# EAGLE design pix6t4 (EAGLE 5.11)
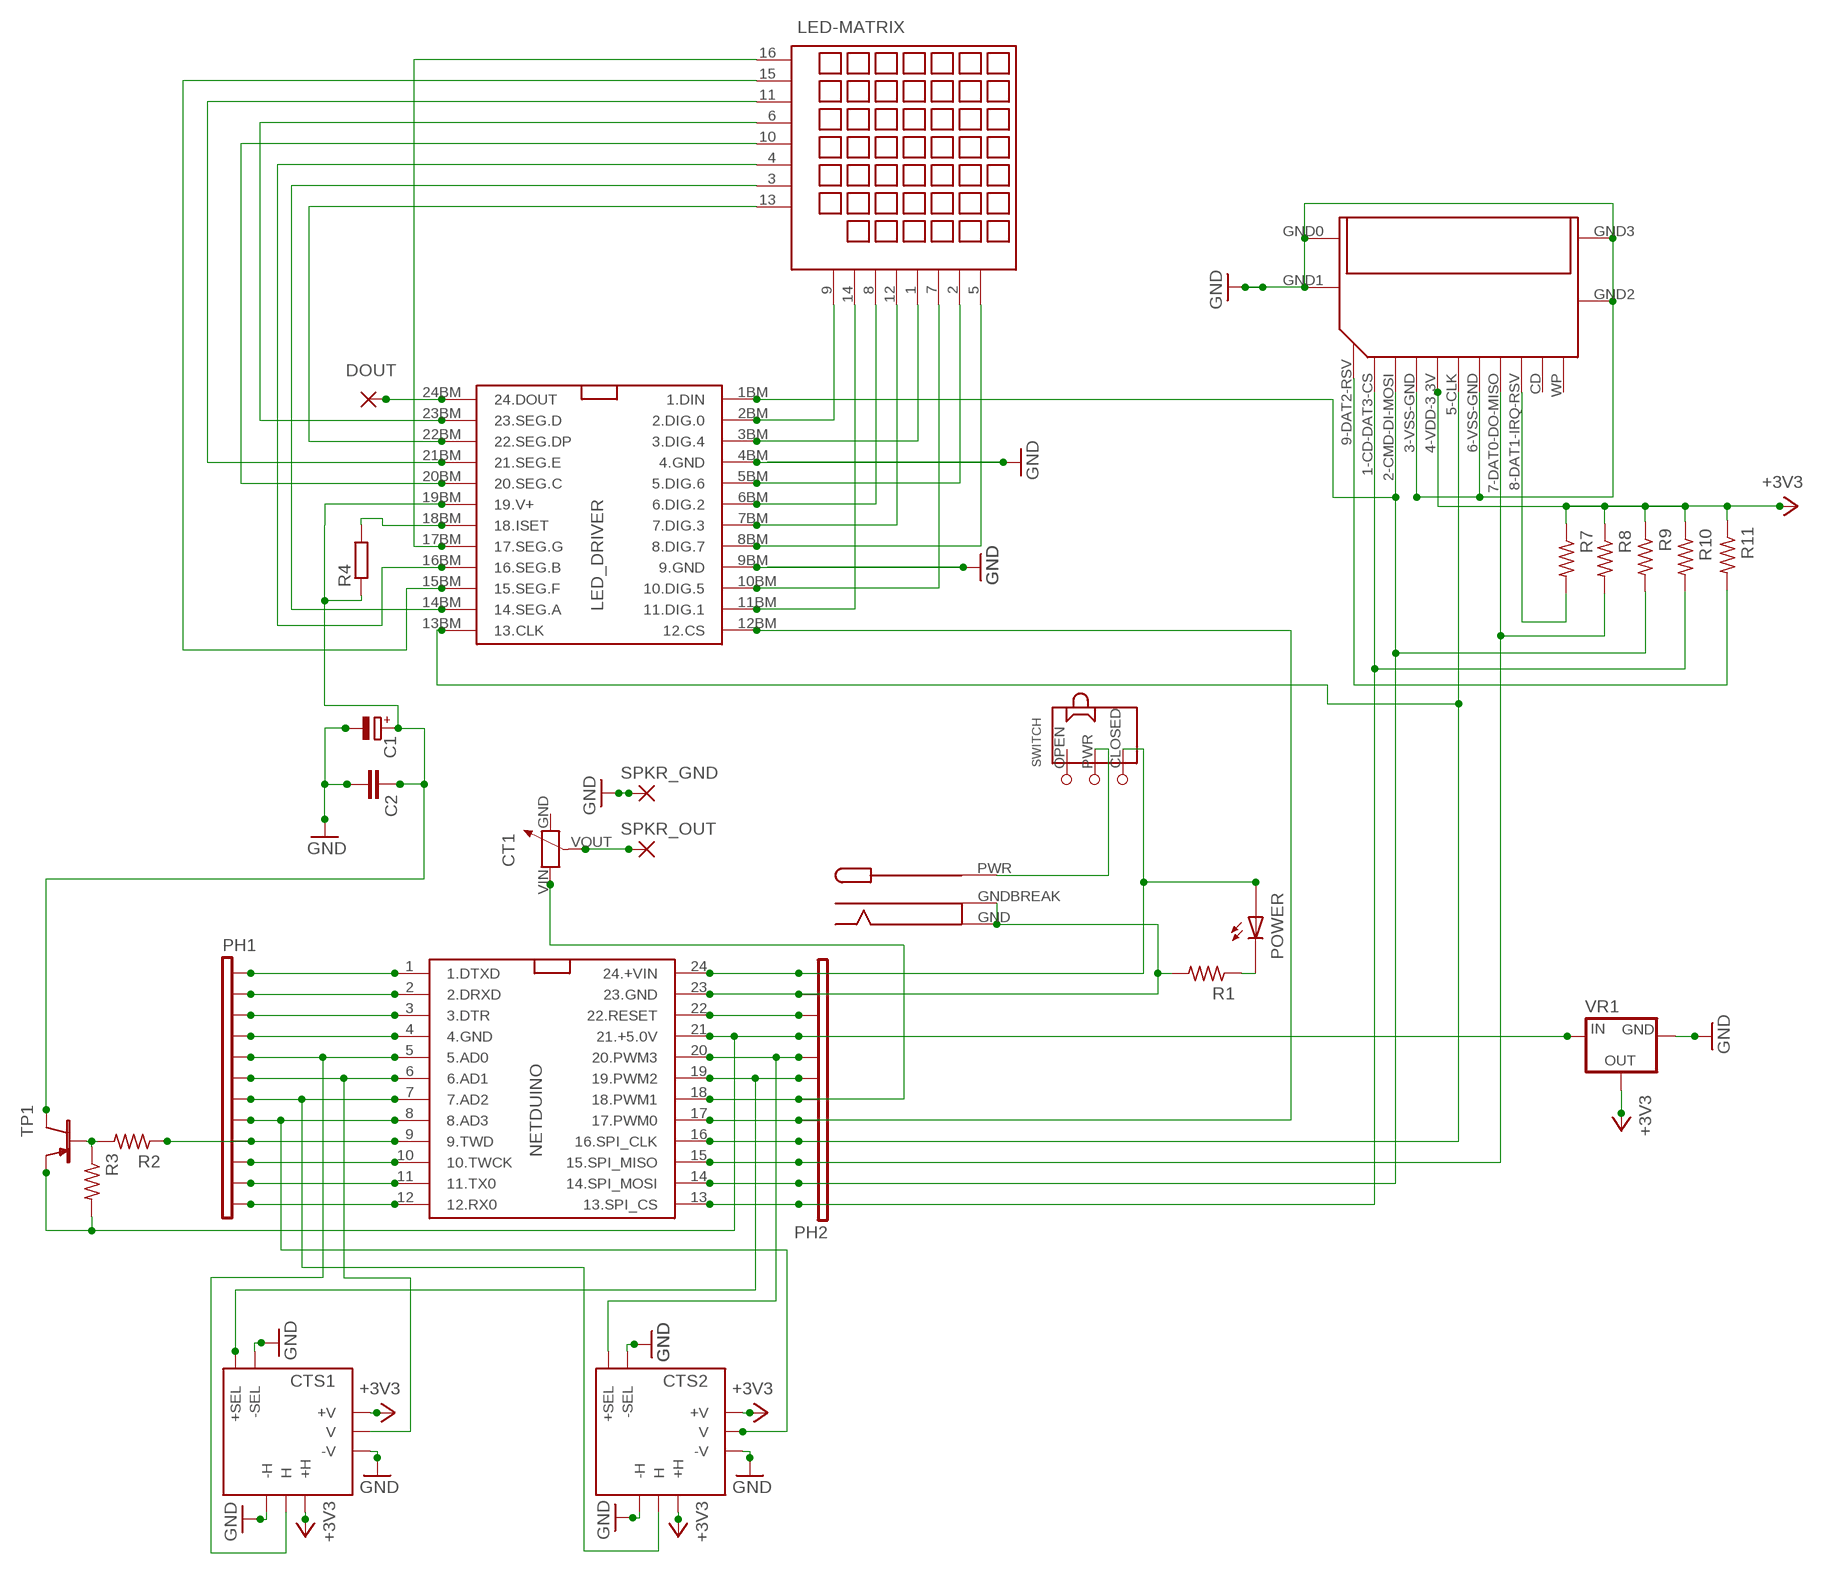
[diagram p0: schematic, sheet 1]

## Parts
C1  CPOL-EUE2.5-5  [E2,5-5]
C2  C-EU025-025X050  [C025-025X050]
CT1  CB10HL  [CARBONTRIMMER]
CTS1  CTS252B103A60NB10K  [JOYSTICK+SWITCH]
CTS2  CTS252B103A60NB10K  [JOYSTICK+SWITCH]
GND  WIREPAD  [WIREPAD]
LED-MATRIX  LEDMS88R-V2SQR  [LEDMATRIX-SQRPIXELS]
LED_DRIVER  LED-DRIVER-BOTTOM-MOUNT  [DIL24-BOTTOM-MOUNT]
NETDUINO  NETDUINO-MINI-V2  [NETDUINO-MINI]
PH1  PINHEADER1X12BREAKAWAY  [PINHEADER]
PH2  PINHEADER1X12BREAKAWAY  [PINHEADER]
POWER  LED  [LED3MM]
PWRJACK  PJ-102A-V2  [DCBARREL]
R1  RESISTOR  [RESISTOR]
R2  RESISTOR  [RESISTOR]
R3  RESISTOR  [RESISTOR]
R4  RESISTOR-FLAT  [RESISTOR-FLAT]
R7  RESISTOR  [RESISTOR]
R8  RESISTOR  [RESISTOR]
R9  RESISTOR  [RESISTOR]
R10  RESISTOR  [RESISTOR]
R11  RESISTOR  [RESISTOR]
SD-SOCKET  SD-101-00708-64-ND-V3  [SMD-SD-SOCKET]
SWITCH  SLIDE-SWITCH-V2  [SLIDE-SWITCH]
TP1  2N4403TO-92  [TRANSISTOR-PNP]
U$1  WIREPAD  [WIREPAD]
U$3  WIREPAD  [WIREPAD]
VR1  VREG-LD33VT0-220  [VOLTAGEREGULATOR]

## Nets
+3V3: CTS1.H+(+H) CTS1.V+(+V) CTS2.H+(+H) CTS2.V+(+V) R7.1 R8.1 R9.1 R10.1 R11.1 SD-SOCKET.4-VDD-3.3V VR1.VOUT(OUT)
+5.0V: NETDUINO.21(21.+5.0V) PH2.9 R3.2 TP1.E VR1.VIN(IN)
+VIN: NETDUINO.24(24.+VIN) PH2.12 POWER.A SWITCH.CLOSED
GND: C1.- C2.2 CTS1.H-(-H) CTS1.SEL-(-SEL) CTS1.V-(-V) CTS2.H-(-H) CTS2.SEL-(-SEL) CTS2.V-(-V) GND.P$1(P) LED_DRIVER.4BM(4.GND) LED_DRIVER.9BM(9.GND) NETDUINO.4(4.GND) NETDUINO.23(23.GND) PH1.4 PH2.11 PWRJACK.GND PWRJACK.GNDBREAK R1.2 SD-SOCKET.3-VSS-GND SD-SOCKET.6-VSS-GND SD-SOCKET.GND0(GND-0) SD-SOCKET.GND1(GND-1) SD-SOCKET.GND2(GND-2) SD-SOCKET.GND3(GND-3) VR1.GND
LED_DRIVER_CURRENT_LIMIT: LED_DRIVER.18BM(18.ISET) R4.2
LED_DRIVER_DATA_OUT: LED_DRIVER.24BM(24.DOUT) U$1.P$1(P)
LED_DRIVER_POWER: C1.+ C2.1 LED_DRIVER.19BM(19.V+) R4.1 TP1.C
LED_DRIVER_POWER_CTRL: NETDUINO.9(9.TWD) PH1.9 R2.1
LED_DRIVER_SPI_CS: LED_DRIVER.12BM(12.CS) NETDUINO.17(17.PWM0) PH2.5
LED_PIN_1: LED-MATRIX.1 LED_DRIVER.3BM(3.DIG.4)
LED_PIN_2: LED-MATRIX.2 LED_DRIVER.5BM(5.DIG.6)
LED_PIN_3: LED-MATRIX.3 LED_DRIVER.14BM(14.SEG.A)
LED_PIN_4: LED-MATRIX.4 LED_DRIVER.16BM(16.SEG.B)
LED_PIN_5: LED-MATRIX.5 LED_DRIVER.8BM(8.DIG.7)
LED_PIN_6: LED-MATRIX.6 LED_DRIVER.23BM(23.SEG.D)
LED_PIN_7: LED-MATRIX.7 LED_DRIVER.10BM(10.DIG.5)
LED_PIN_8: LED-MATRIX.8 LED_DRIVER.6BM(6.DIG.2)
LED_PIN_9: LED-MATRIX.9 LED_DRIVER.2BM(2.DIG.0)
LED_PIN_10: LED-MATRIX.10 LED_DRIVER.20BM(20.SEG.C)
LED_PIN_11: LED-MATRIX.11 LED_DRIVER.21BM(21.SEG.E)
LED_PIN_12: LED-MATRIX.12 LED_DRIVER.7BM(7.DIG.3)
LED_PIN_13: LED-MATRIX.13 LED_DRIVER.22BM(22.SEG.DP)
LED_PIN_14: LED-MATRIX.14 LED_DRIVER.11BM(11.DIG.1)
LED_PIN_15: LED-MATRIX.15 LED_DRIVER.15BM(15.SEG.F)
LED_PIN_16: LED-MATRIX.16 LED_DRIVER.17BM(17.SEG.G)
LEFT_STICK_BUTTON: CTS1.SEL+(+SEL) NETDUINO.19(19.PWM2) PH2.7
LEFT_STICK_X: CTS1.H-OUT(H) NETDUINO.5(5.AD0) PH1.5
LEFT_STICK_Y: CTS1.V-OUT(V) NETDUINO.6(6.AD1) PH1.6
N$1: POWER.K(C) R1.1
N$5: R7.2 SD-SOCKET.8-DAT1-IRQ-RSV
N$6: NETDUINO.1(1.DTXD) PH1.1
N$7: R11.2 SD-SOCKET.9-DAT2-RSV
N$8: NETDUINO.2(2.DRXD) PH1.2
N$9: NETDUINO.3(3.DTR) PH1.3
N$10: R2.2 R3.1 TP1.B
N$14: NETDUINO.12(12.RX0) PH1.12
N$15: NETDUINO.11(11.TX0) PH1.11
N$16: NETDUINO.10(10.TWCK) PH1.10
N$20: CT1.VOUT U$3.P$1(P)
PWR: PWRJACK.PWR SWITCH.PWR
RESET: NETDUINO.22(22.RESET) PH2.10
RIGHT_STICK_BUTTON: CTS2.SEL+(+SEL) NETDUINO.20(20.PWM3) PH2.8
RIGHT_STICK_X: CTS2.H-OUT(H) NETDUINO.7(7.AD2) PH1.7
RIGHT_STICK_Y: CTS2.V-OUT(V) NETDUINO.8(8.AD3) PH1.8
SPEAKER: CT1.VIN NETDUINO.18(18.PWM1) PH2.6
SPI_CLK: LED_DRIVER.13BM(13.CLK) NETDUINO.16(16.SPI_CLK) PH2.4 SD-SOCKET.5-CLK
SPI_MISO: NETDUINO.15(15.SPI_MISO) PH2.3 R8.2 SD-SOCKET.7-DAT0-DO-MISO
SPI_MOSI: LED_DRIVER.1BM(1.DIN) NETDUINO.14(14.SPI_MOSI) PH2.2 R9.2 SD-SOCKET.2-CMD-DI-MOSI
SPI_SD_CS: NETDUINO.13(13.SPI_CS) PH2.1 R10.2 SD-SOCKET.1-CD-DAT3-CS
Unconnected: CT1.GND SD-SOCKET.CD SD-SOCKET.WP SWITCH.OPEN

## Notes on the sheet
- DOUT
- SPKR_GND
- SPKR_OUT

## Library data of the parts
C1 = rcl:CPOL-EU: POLARIZED CAPACITOR, European symbol
C2 = rcl:C-EU: CAPACITOR, European symbol
CT1 = nwazet:CB10*: TE Connectivity Carbon Economy Trimmer Type CB10 Series
CTS1 CTS2 = nwazet:CTS252B103A60NB: CTS Series 252 Mini Joystick Two Axis, Mini-joystick With Momentary Switch
GND U$1 U$3 = nwazet:WIREPAD
LED-MATRIX = nwazet:LEDMS88R-V2
LED_DRIVER = nwazet:LED-DRIVER-BOTTOM-MOUNT
NETDUINO = nwazet:NETDUINO-MINI-V2
PH1 PH2 = nwazet:PINHEADER1X12
POWER = nwazet:LED
PWRJACK = nwazet:PJ-102A-V2
R1-R3 R7-R11 = nwazet:RESISTOR
R4 = nwazet:RESISTOR-FLAT
SD-SOCKET = nwazet:SD-101-00708-64-ND-V3
SWITCH = nwazet:SLIDE-SWITCH-V2
TP1 = nwazet:2N4403: PNP General Purpose Transistor PNP silicon - straight leads, MAXIMUM RATINGS: Collector ? Emitter Voltage VCEO 40 Vdc, Collector ? Base Voltage VCBO 40 Vdc, Emitter ? Base Voltage VEBO 5.0 Vdc, Collector Current ? Continuous IC 600 mAdc, Total Device Dissipation @ TA = 25°C Datasheet <http://download.siliconexpert.com/pdfs/2007/03/26/semi_ap/3/ons/bipolar%20transistors/2n4403-d.pdf>
VR1 = nwazet:VREG-LD33V

## Board
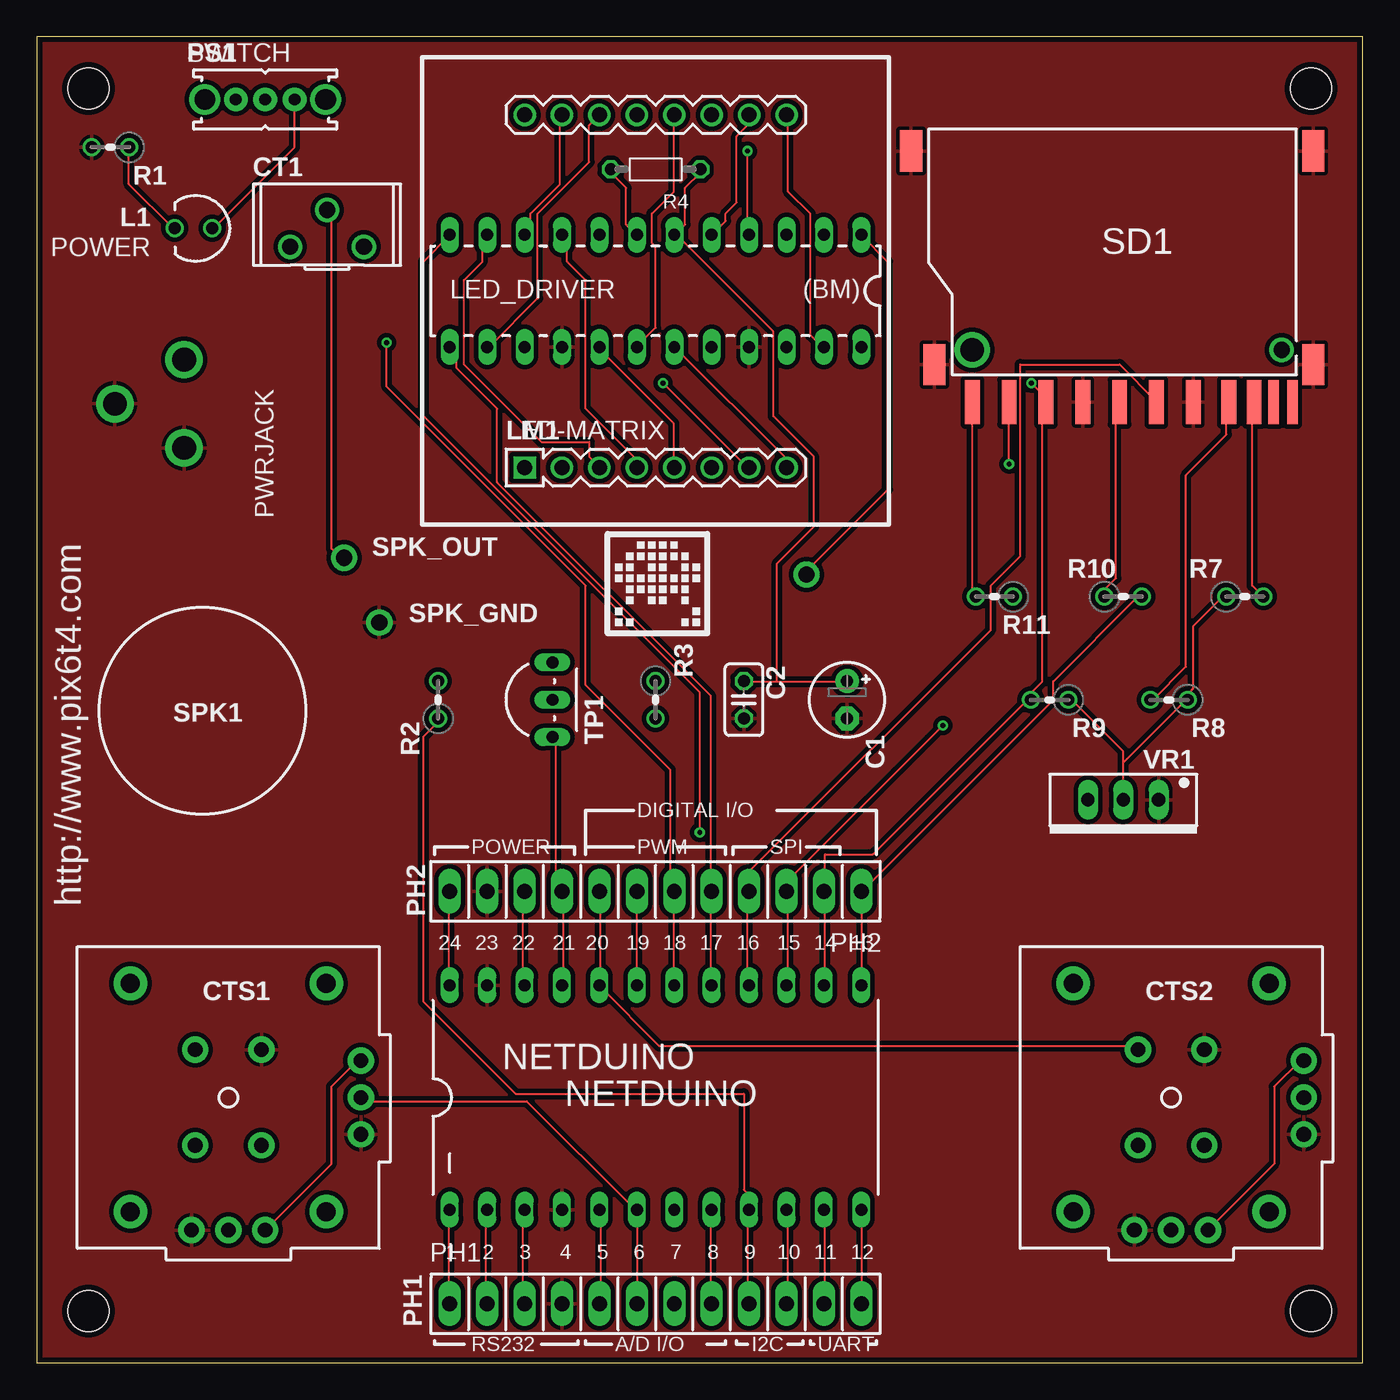
[diagram p1: board, top side]
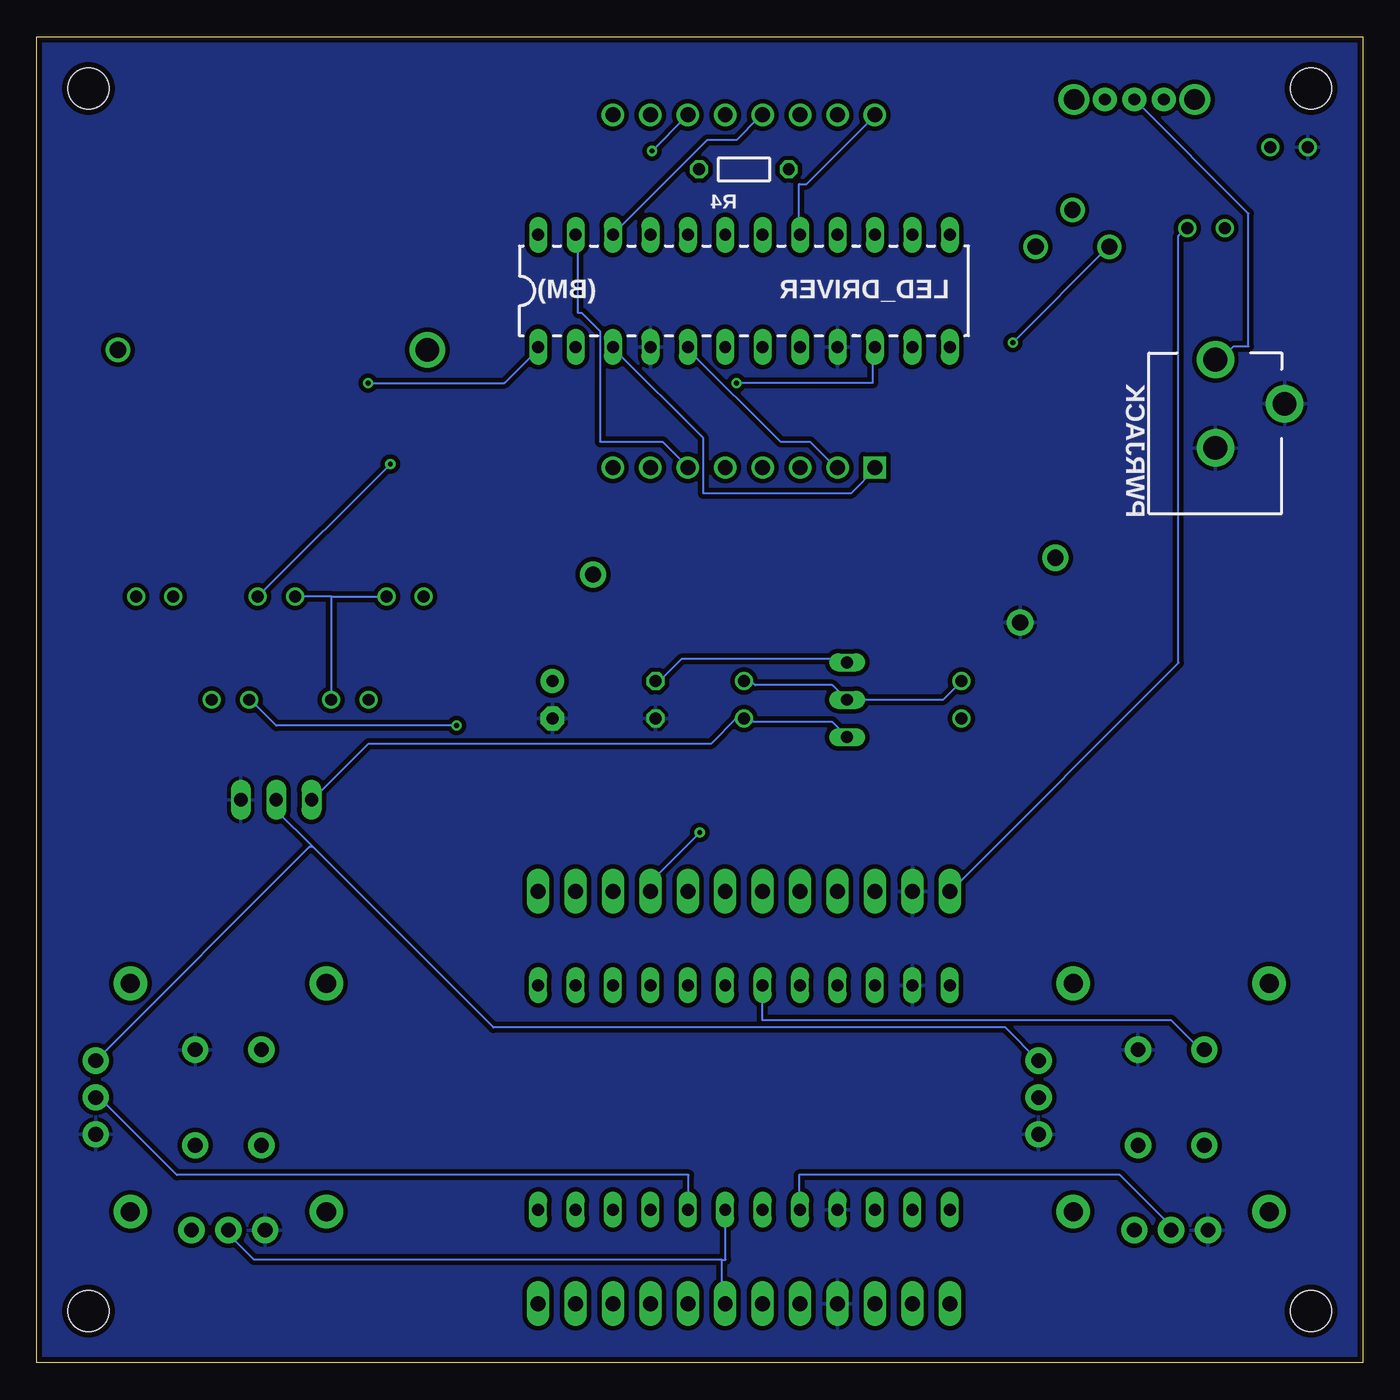
[diagram p2: board, bottom side, seen from below]

Size 90 x 90 mm. Coordinates in mm from the lower left corner, seen from the top.
Outline: 0,0 90,0 90,90 0,90 0,0
Copper layers (1*16): Top 0.0356mm / dielectric 1.5011mm / Bottom 0.0356mm
Design rules "LaenPCBOrder": minimum track width 6mil, minimum drill 13mil, track to track 6mil, track to pad 6mil, pad to pad 6mil, via to via 6mil, smd to smd 6mil, copper to edge 15mil, drill to drill 6mil, minimum pad ring 7mil, minimum via ring 7mil, stop-mask expansion 4mil, vias tented up to drill 0mil, thermal gap 10mil
Holes 2.8 mm at 3.5,3.5 86.5,3.5 86.5,86.5 3.5,86.5

### Footprints (pad centres in the part's own frame; a part is rotated, then mirrored left to right if it is on the bottom)
E2,5-5 = drill 0.813 pad 1.6 round: + -1.27,0 | drill 0.813 pad 1.6 octagon: - 1.27,0
C025-025X050 = drill 0.813 octagon: 1 -1.27,0; 2 1.27,0
CARBONTRIMMER = drill 1.1 round: GND 2.5,-1.25; VIN -2.5,-1.25; VOUT 0,1.25
JOYSTICK+SWITCH = drill 1 pad 1.778 round: B 2.25,-3.25; D -2.25,-3.25; H+ 2.5,-9; H- -2.5,-9; H-OUT 0,-9; SEL+ -2.25,3.25; SEL- 2.25,3.25; V+ 9,2.5; V- 9,-2.5; V-OUT 9,0 | drill 1.3 pad 2.286 round: MOUNT1 -6.65,7.75; MOUNT2 -6.65,-7.75; MOUNT3 6.65,-7.75; MOUNT4 6.65,7.75
WIREPAD = drill 1.1 pad 1.778 round: P$1 0,0
LEDMATRIX-SQRPIXELS = drill 1.016 square: 1 -8.89,-11.99 | drill 1.016 round: 2 -6.35,-11.99; 3 -3.81,-11.99; 4 -1.27,-11.99; 5 1.27,-11.99; 6 3.81,-11.99; 7 6.35,-11.99; 8 8.89,-11.99; 9 8.89,11.96; 10 6.35,11.96; 11 3.81,11.96; 12 1.27,11.96; 13 -1.27,11.96; 14 -3.81,11.96; 15 -6.35,11.96; 16 -8.89,11.96
DIL24-BOTTOM-MOUNT = drill 0.813 long: 1BM 13.97,-3.81; 2BM 11.43,-3.81; 3BM 8.89,-3.81; 4BM 6.35,-3.81; 5BM 3.81,-3.81; 6BM 1.27,-3.81; 7BM -1.27,-3.81; 8BM -3.81,-3.81; 9BM -6.35,-3.81; 10BM -8.89,-3.81; 11BM -11.43,-3.81; 12BM -13.97,-3.81; 13BM -13.97,3.81; 14BM -11.43,3.81; 15BM -8.89,3.81; 16BM -6.35,3.81; 17BM -3.81,3.81; 18BM -1.27,3.81; 19BM 1.27,3.81; 20BM 3.81,3.81; 21BM 6.35,3.81; 22BM 8.89,3.81; 23BM 11.43,3.81; 24BM 13.97,3.81
NETDUINO-MINI = drill 0.813 long: 1 -13.97,-7.62; 2 -11.43,-7.62; 3 -8.89,-7.62; 4 -6.35,-7.62; 5 -3.81,-7.62; 6 -1.27,-7.62; 7 1.27,-7.62; 8 3.81,-7.62; 9 6.35,-7.62; 10 8.89,-7.62; 11 11.43,-7.62; 12 13.97,-7.62; 13 13.97,7.62; 14 11.43,7.62; 15 8.89,7.62; 16 6.35,7.62; 17 3.81,7.62; 18 1.27,7.62; 19 -1.27,7.62; 20 -3.81,7.62; 21 -6.35,7.62; 22 -8.89,7.62; 23 -11.43,7.62; 24 -13.97,7.62
PINHEADER = drill 1.016 long: 1 -13.97,0; 2 -11.43,0; 3 -8.89,0; 4 -6.35,0; 5 -3.81,0; 6 -1.27,0; 7 1.27,0; 8 3.81,0; 9 6.35,0; 10 8.89,0; 11 11.43,0; 12 13.97,0
LED3MM = drill 0.813 round: A -1.27,0; K 1.27,0
DCBARREL = drill 1.6 pad 2.54 round: GND 0,-2.91; GNDBREAK -4.7,0.09; PWR 0,3.09
RESISTOR = drill 0.813 round: 1 -1.27,0; 2 1.27,0
RESISTOR-FLAT = drill 0.813 octagon: 1 -3.04,0; 2 3.04,0
SMD-SD-SOCKET = smd 1 x 3: 1-CD-DAT3-CS -7,-3.55; 2-CMD-DI-MOSI -4.5,-3.55; 3-VSS-GND -2,-3.55; 4-VDD-3.3V 0.5,-3.55; 5-CLK 3,-3.55; 6-VSS-GND 5.5,-3.55; 7-DAT0-DO-MISO 7.92,-3.55; 8-DAT1-IRQ-RSV 9.62,-3.55; 9-DAT2-RSV -9.5,-3.55 | smd 0.7 x 3: CD 10.96,-3.55; WP 12.23,-3.55 | smd 1.5 x 2.8: GND0 -13.65,13.5; GND1 -12.07,-1; GND2 13.65,-1; GND3 13.65,13.5 | drill 1.6 pad 1.67 round: P$1 -9.5,0 | drill 1.1 pad 1.27 round: P$3 11.5,0
SLIDE-SWITCH = drill 0.8 pad 1.6 round: CLOSED 2,0; OPEN -2,0; PWR 0,0 | drill 1.4 pad 1.6 round: NC -4.1,0; NC1 4.1,0
TRANSISTOR-PNP = drill 0.813 long: B 0,0; C 2.54,0; E -2.54,0
VOLTAGEREGULATOR = drill 0.9 long: GND -2.4,-0.02; VIN 2.4,-0.02; VOUT 0,-0.02

### Placement (x,y rotation side)
C1  55,45 270 top
C2  48,45 270 top
CT1  19.7,77 0 top
CTS1  13,18 0 top
CTS2  77,18 0 top
GND  23.25,50.25 0 top
LED-MATRIX  42,72.75 0 top
LED_DRIVER  42,72.75 0 top
NETDUINO  42,18 0 top
PH1  42,4 0 top
PH2  42,32 180 top
POWER  10.63,77 180 top
PWRJACK  10,65 0 top
R1  5,82.5 180 top
R2  27.25,45 90 top
R3  42,45 270 top
R4  42,81 180 top
R7  82,52 0 top
R8  76.85,45 180 top
R9  68.75,45 180 top
R10  73.75,52 0 top
R11  65,52 180 top
SD-SOCKET  73,68.75 0 top
SWITCH  15.5,85.75 0 top
TP1  35,45 90 top
U$1  52.25,53.5 0 top
U$3  20.86,54.64 0 top
VR1  73.75,38.19 180 top

### Tracks (layer width: path | path; a pad name or v marks a point on that pad's centre or on a via)
+3V3
  Top 0.152: CTS2.H+ 84,13.5 84,18.75 85.75,20.5 CTS2.V+ | CTS1.H+ 20,13.5 20,18.75 21.75,20.5 CTS1.V+ | SD-SOCKET.4-VDD-3.3V 73.5,65 73.25,64.75 73.25,53.25 72.5,52.5 72.5,52 R10.1 | 73.75,40.75 73.75,38.25 VR1.VOUT | 73.75,40.75 73.75,41.5 70.25,45 R9.1 | 73.75,40.75 78,45 R8.1 78.25,45 78.25,45.5 78.5,45.75 78.5,50 80.5,52 R7.1
  Bottom 0.152: 70,52 72.25,52 R10.1 | 70,52 66.5,52 R11.1 | 70,52 70,45 R9.1 | CTS1.V+ 24.25,22.75 59,22.75 71.25,35 | 71.25,35 73.75,37.5 73.75,38 VR1.VOUT | CTS2.V+ 71.5,35 71.25,35
+5.0V
  Top 0.152: NETDUINO.21 35.75,25.75 35.75,32 PH2.9 35.5,32 35.25,32.25 35.25,42 35,42.25 TP1.E
  Bottom 0.152: TP1.E 35,42.5 36,43.5 42,43.5 R3.2 42,43.75 42.5,43.75 44.25,42 67.5,42 71.25,38.25 VR1.VIN
+VIN
  Top 0.152: SWITCH.CLOSED 17.5,82.5 12,77 POWER.A | NETDUINO.24 28,25.75 28,32 PH2.12
  Bottom 0.152: POWER.A 12,77 12.5,76.5 12.5,47.5 28,32 PH2.12
GND
  pour Top (isolate 0.305): 0,89.97 89.97,89.97 89.97,0 0,0
  pour Bottom (isolate 0.305): 0,89.97 89.97,89.97 89.97,0 0,0
LED_DRIVER_CURRENT_LIMIT
  Top 0.152: LED_DRIVER.18BM 40.5,76.75 40,77.25 40,79.75 39,80.75 39,81 R4.2
LED_DRIVER_DATA_OUT
  Top 0.152: U$1.P$1 52.25,53.75 57.75,59.25 57.75,74.75 56,76.5 LED_DRIVER.24BM
LED_DRIVER_POWER
  Top 0.152: R4.1 45,81 45,80.75 44,79.75 44,77.25 43.5,76.75 LED_DRIVER.19BM 43.5,76.5 50,70 50,64.25 52.75,61.5 52.75,56.75 50.25,54.25 50.25,46.25 | 50.25,46.25 48,46.25 C2.1 | 50.25,46.25 55,46.25 C1.+
  Bottom 0.152: TP1.C 35,47.75 46.25,47.75 47.5,46.5 48,46.5 C2.1
LED_DRIVER_POWER_CTRL
  Top 0.152: PH1.9 48.25,4 48.25,10.25 NETDUINO.9 48.25,10.5 48.25,11.5 48,11.75 48,18.25 32.5,18.25 26.25,24.5 26.25,42.5 27.25,43.5 R2.1
LED_DRIVER_SPI_CS
  Top 0.152: 45.75,32 45.75,45.25 31.25,59.75 31.25,64.75 28.5,67.5 28.5,68.5 28.25,68.75 LED_DRIVER.12BM | 45.75,32 45.75,25.75 NETDUINO.17 | 45.75,32 PH2.5
LED_PIN_1
  Bottom 0.152: LED_DRIVER.3BM 50.75,68.75 44.75,62.75 44.75,59 34.75,59 33,60.75 LED-MATRIX.1
LED_PIN_2
  Bottom 0.152: LED_DRIVER.5BM 45.75,68.75 39.5,62.5 37.5,62.5 36,61 35.75,61 LED-MATRIX.2
LED_PIN_3
  Top 0.152: LED_DRIVER.14BM 30.5,76.5 30.25,76.25 30.25,74.75 29,73.5 29,67.75 34.25,62.5 37.5,62.5 37.5,61.5 38,61 LED-MATRIX.3
LED_PIN_4
  Top 0.152: LED_DRIVER.16BM 35.75,76.5 36,76.25 36,74.75 37.25,73.5 37.25,64.75 40.5,61.5 40.5,61 LED-MATRIX.4
LED_PIN_5
  Top 0.152: LED_DRIVER.8BM 38.25,68.75 43.25,63.75 43.25,61 LED-MATRIX.5
LED_PIN_6
  Bottom 0.152: LED_DRIVER.23BM 53.25,76.5 53.25,71.25 53,71.25 51.75,70 51.75,62.5 47.5,62.5 46,61 LED-MATRIX.6
LED_PIN_7  (via drill 0.33)
  Top 0.152: v42.5,66.5 48.25,60.75 LED-MATRIX.7
  Bottom 0.152: v42.5,66.5 33.25,66.5 33.25,68.75 LED_DRIVER.10BM
LED_PIN_8
  Top 0.152: LED_DRIVER.6BM 43.5,68.75 50.75,61.5 50.75,61 LED-MATRIX.8
LED_PIN_9
  Top 0.152: LED_DRIVER.2BM 53.25,69 52.5,69.75 52.5,78 51,79.5 51,84.5 LED-MATRIX.9
LED_PIN_10
  Top 0.152: LED_DRIVER.20BM 46,76.75 46.75,77.5 46.75,78 47.5,78.75 47.5,83.25 48.25,84 48.25,84.5 LED-MATRIX.10
LED_PIN_11  (via drill 0.33)
  Top 0.152: v48.25,82.25 48.25,76.75 LED_DRIVER.21BM
  Bottom 0.152: v48.25,82.25 46,84.5 LED-MATRIX.11
LED_PIN_12
  Top 0.152: LED_DRIVER.7BM 40.75,69 42,70.25 42,75.75 41.75,76 41.75,78 43.25,79.5 43.25,84.5 LED-MATRIX.12
LED_PIN_13
  Bottom 0.152: LED_DRIVER.22BM 50.75,76.75 44.5,83 42.5,83 41,84.5 40.75,84.5 LED-MATRIX.13
LED_PIN_14
  Top 0.152: LED_DRIVER.11BM 30.75,69 34,72.25 34,78 37.5,81.5 37.5,84 38,84.5 LED-MATRIX.14
LED_PIN_15
  Top 0.152: LED_DRIVER.15BM 33.25,76.75 33.5,77 33.5,78 35.5,80 35.5,84.5 LED-MATRIX.15
LED_PIN_16
  Bottom 0.152: LED_DRIVER.17BM 38.25,76.75 38.25,80 37.75,80 33.25,84.5 LED-MATRIX.16
LEFT_STICK_BUTTON
  Top 0.152: PH2.7 40.75,32 40.75,25.75 NETDUINO.19
  Bottom 0.152: CTS1.SEL+ 11,21.25 13,23.25 40.75,23.25 40.75,25.5 NETDUINO.19
LEFT_STICK_X
  Top 0.152: PH1.5 38.25,4 38.25,10.25 NETDUINO.5
  Bottom 0.152: CTS1.H-OUT 13,9.25 16.5,12.75 38.25,12.75 38.25,10.5 NETDUINO.5
LEFT_STICK_Y
  Top 0.152: CTS1.V-OUT 22,17.75 33.25,17.75 40.5,10.5 NETDUINO.6 40.75,10.25 40.75,4 PH1.6
N$1
  Top 0.152: POWER.K 9.25,77 6.25,80 6.25,82.5 R1.1
N$5
  Top 0.152: R7.2 83.25,52 82.5,52.75 82.5,65 SD-SOCKET.8-DAT1-IRQ-RSV
N$6
  Top 0.152: NETDUINO.1 28,10.25 28,4 PH1.1
N$7
  Top 0.152: R11.2 63.5,52 63.5,65 SD-SOCKET.9-DAT2-RSV
N$8
  Top 0.152: NETDUINO.2 30.5,10.25 30.5,4 PH1.2
N$9
  Top 0.152: NETDUINO.3 33,10.25 33,4 PH1.3
N$10
  Bottom 0.152: R3.1 42,46.25 41.5,46.25 41.25,46 36,46 TP1.B 28.5,45 27.25,46.25 R2.2
N$14
  Top 0.152: NETDUINO.12 56,10.25 56,4 PH1.12
N$15
  Top 0.152: NETDUINO.11 53.5,10.25 53.5,4 PH1.11
N$16
  Top 0.152: NETDUINO.10 51,10.25 51,4 PH1.10
N$20
  Top 0.152: CT1.VOUT 19.75,78.25 20,78 20,55.25 20.75,54.5 U$3.P$1
PWR
  Bottom 0.152: SWITCH.PWR 7.75,78 7.75,69 8.75,69 9.5,68.25 10,68.25 PWRJACK.PWR
RESET
  Top 0.152: NETDUINO.22 33,25.75 33,32 PH2.10
RIGHT_STICK_BUTTON
  Top 0.152: CTS2.SEL+ 74.75,21.5 42.25,21.5 38.25,25.5 NETDUINO.20 38.25,25.75 38.25,32 PH2.8
RIGHT_STICK_X
  Bottom 0.152: 43.5,7 43.25,7 43.25,10.25 NETDUINO.7 | 43.5,7 75.25,7 77,8.75 CTS2.H-OUT | 43.5,7 43.5,4 PH1.7
RIGHT_STICK_Y
  Top 0.152: PH1.8 45.75,4 45.75,10.25 NETDUINO.8
  Bottom 0.152: CTS2.V-OUT 85.75,18 80.5,12.75 45.75,12.75 45.75,10.5 NETDUINO.8
SPEAKER  (via drill 0.33)
  Top 0.152: 43.25,32 43,32.25 43,40.25 37.25,46 37.25,52.75 23.75,66.25 v23.75,69.25 | 43.25,32 43.25,25.75 NETDUINO.18 | 43.25,32 PH2.6 43.25,32
  Bottom 0.152: v23.75,69.25 17.25,75.75 CT1.VIN
SPI_CLK  (via drill 0.33)
  Top 0.152: v45,36 45,45.5 26.25,64.25 26.25,74.75 28,76.5 LED_DRIVER.13BM | SD-SOCKET.5-CLK 76,65.25 73.5,67.75 66.75,67.75 66.75,54.75 64.75,52.75 64.75,49.75 48.5,33.5 48.5,32 PH2.4 48.25,32 48.25,25.75 NETDUINO.16
  Bottom 0.152: v45,36 48.25,32.75 48.25,32 PH2.4
SPI_MISO  (via drill 0.33)
  Top 0.152: 51,32 51,25.75 NETDUINO.15 | R8.2 75.75,45 78,47.25 78,60.25 80.75,63 80.75,65 SD-SOCKET.7-DAT0-DO-MISO | 51,32 51.5,32.5 51.5,33.25 v61.5,43.25 | 51,32 PH2.3
  Bottom 0.152: v61.5,43.25 73.75,43.25 75.5,45 R8.2
SPI_MOSI  (via drill 0.33)
  Top 0.152: v67.5,66.5 68.5,65.5 68.5,65.25 SD-SOCKET.2-CMD-DI-MOSI 68.5,65 68.25,64.75 68.25,46.25 67.5,45.5 67.5,45 R9.2 67.25,45 56.75,34.5 53.5,34.5 53.5,32 | 53.5,32 53.5,25.75 NETDUINO.14 | 53.5,32 PH2.2
  Bottom 0.152: v67.5,66.5 58.25,66.5 56,68.75 LED_DRIVER.1BM
SPI_SD_CS  (via drill 0.33)
  Top 0.152: 56,32 56,25.75 NETDUINO.13 | v66,61 66,65 SD-SOCKET.1-CD-DAT3-CS | 56,32 69,45 69,46.25 74.75,52 75,52 R10.2 | 56,32 PH2.1
  Bottom 0.152: v66,61 75,52 R10.2

### Text on the board
_tsilk: PS1 | R1 | CT1 | L1 | SD1 | LM1 | SPK_OUT | R10 | R7 | R11 | SPK_GND | R3 | C2 | SPK1 | R9 | R8 | C1 | TP1 | VR1 | R2 | DIGITAL I/O | PH2 | POWER | PWM | SPI | http://www.pix6t4.com | 24 | 23 | 22 | 21 | 20 | 19 | 18 | 17 | 16 | 15 | 14 | 13 | CTS1 | CTS2 | NETDUINO | 1 | 2 | 3 | 4 | 5 | 6 | 7 | 8 | 9 | 10 | 11 | 12 | PH1 | RS232 | A/D I/O | I2C | UART
_bsilk: R4 | LED_DRIVER | (BM) | PWRJACK